# Altium schematic sheet TE0890.SchDoc: TE0890 - S7Mini
size A4; Organization: Trenz Electronic GmbH; DocumentNumber: TE0890; Revision: 01; SheetNumber: 1; SheetTotal: 6; Date: 2018-08-06; Author: Vitali Tsiukala; CompanyName: Trenz Electronic GmbH; DrawnBy: Vitali Tsiukala; Engineer: Vitali Tsiukala; ProjectName: TE0723 Arduino
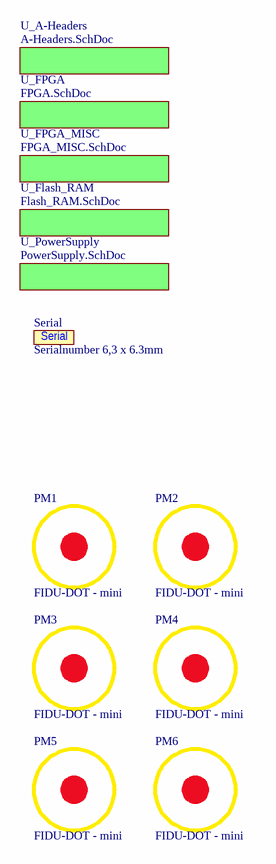
[diagram p0: TE0890.SchDoc]

## Parts
PM1  FIDU-DOT - mini  [FIDU-DOT - mini]
PM2  FIDU-DOT - mini  [FIDU-DOT - mini]
PM3  FIDU-DOT - mini  [FIDU-DOT - mini]
PM4  FIDU-DOT - mini  [FIDU-DOT - mini]
PM5  FIDU-DOT - mini  [FIDU-DOT - mini]
PM6  FIDU-DOT - mini  [FIDU-DOT - mini]
Serial  Serialnumber 6,3 x 6.3mm  [Serial_6.3x6.3mm]  (no BOM)

## Sub-sheets
U_A-Headers = A-Headers.SchDoc: no entries
U_Flash_RAM = Flash_RAM.SchDoc: no entries
U_FPGA = FPGA.SchDoc: no entries
U_FPGA_MISC = FPGA_MISC.SchDoc: no entries
U_PowerSupply = PowerSupply.SchDoc: no entries

## Notes on the sheet
- Title:
- Number:
- Rev.
- Date:
- A4
- Copyright:
- Page
- of
- Filename:

## Library data of the parts
PM1-PM6 = 27037: FIDU-DOT - MINI 0.5mm; AN: 27037; Mixed: FIDU
Serial = 26753: AN: 26753; H-ART: 39068; Mixed: MECH